# Altium schematic sheet 03_Power.SchDoc
size 297 x 209 mm; SheetNumber: 3; SheetTotal: 5; Page Create Date: March  8, 1995; Page Number: 3; Page Size: A4; Reviewer: Default; Page Count: 5; Designer: Dennis; Page Name: 03_Power; RevCode: 1.0; DsnPath: H:\PCB\2026\狼王傻波一\20260204_V0_ELRS-RX\ELRS-RX-MODULE-V11\ELRS-RX-MODULE-V11-20260127.DSN; SchematicName: SCHEMATIC1; PageName: 03_Power; PageSize: A4; TopSchematic: True
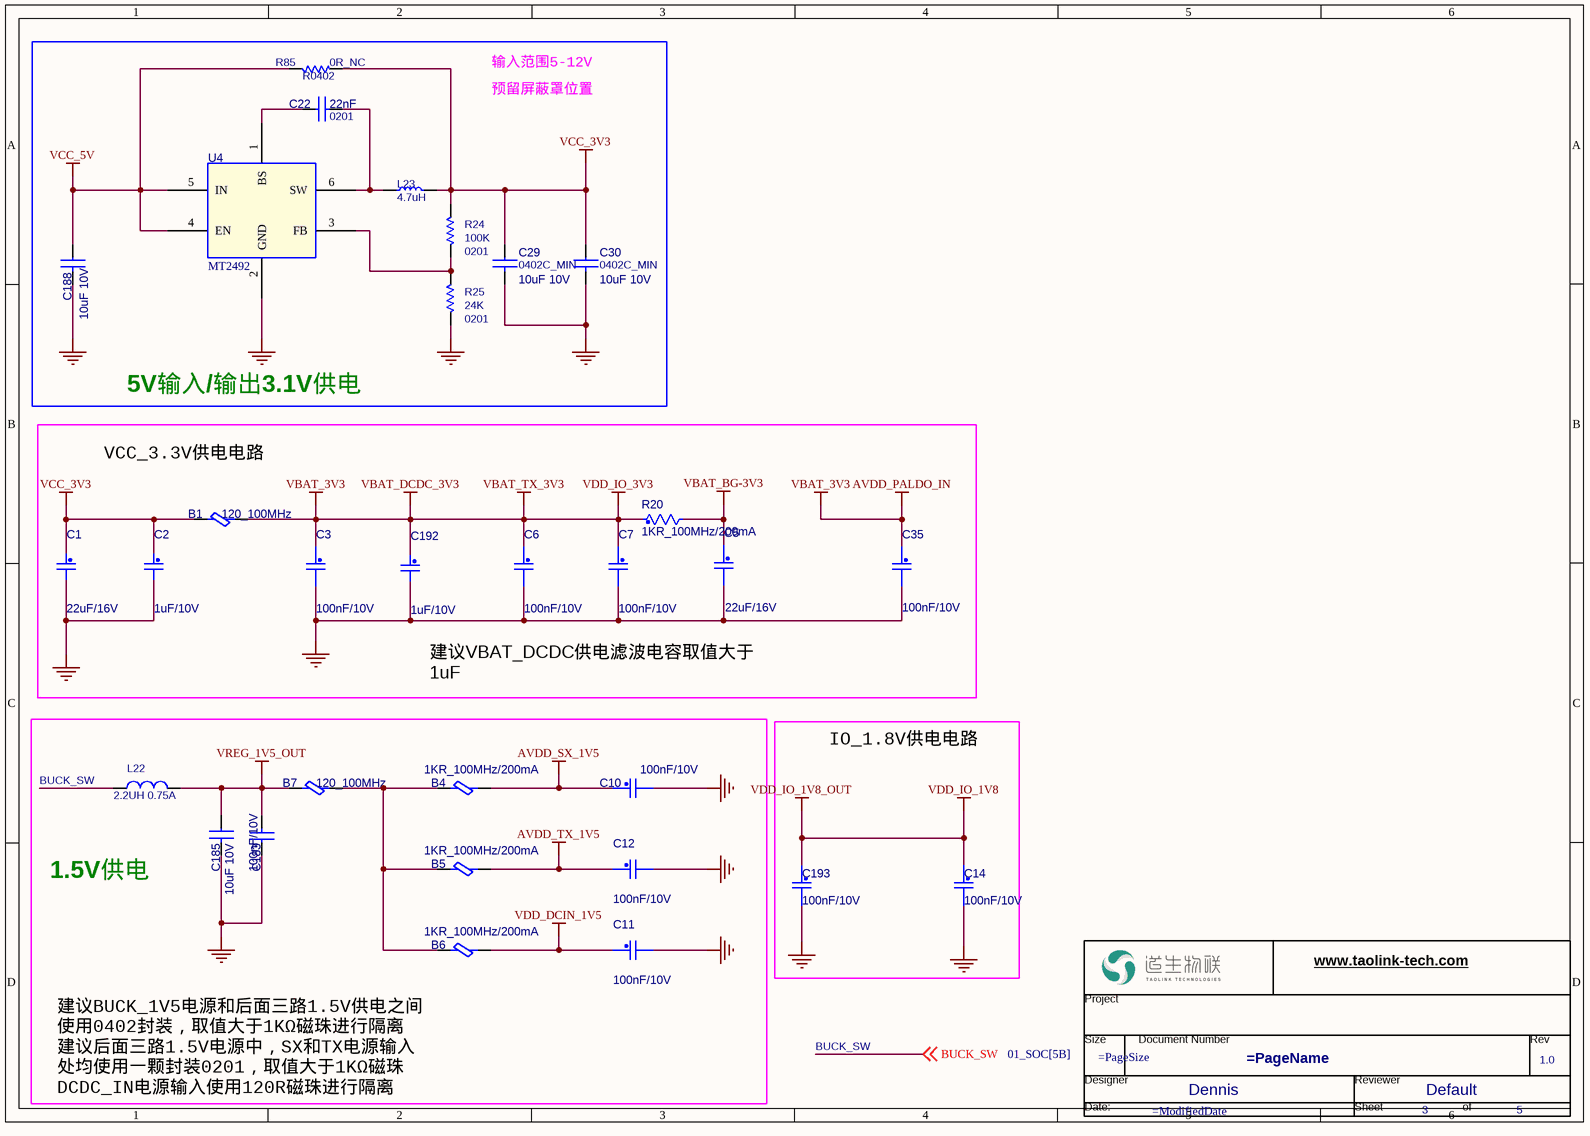
[diagram p0: 03_Power.SchDoc]

## Parts
*  RevCode: 1.0  Designer: Dennis  Reviewer: Default  Page Number: 3  Page Count: 5  (graphical)
B1  120_100MHz  [l0402]
B4  1KR_100MHz/200mA  [0201]
B5  1KR_100MHz/200mA  [0201]
B6  1KR_100MHz/200mA  [0201]
B7  120_100MHz  [l0402]
C1  22uF/16V  [C0402]
C2  1uF/10V  [0201]
C3  100nF/10V  [0201]
C5  22uF/16V  [C0402]
C6  100nF/10V  [0201]
C7  100nF/10V  [0201]
C10  100nF/10V  [0201]
C11  100nF/10V  [0201]
C12  100nF/10V  [0201]
C14  100nF/10V  [0201]
C22  22nF  [0201]
C29  10uF 10V  [0402C_MIN]
C30  10uF 10V  [0402C_MIN]
C35  100nF/10V  [0201]
C183  100nF/10V  [0201]
C185  10uF 10V  [0402C_MIN]
C188  10uF 10V  [0402C_MIN]
C192  1uF/10V  [0201]
C193  100nF/10V  [0201]
L22  2.2UH 0.75A  [C0603]
L23  4.7uH  [R0603]
R20  1KR_100MHz/200mA  [0201]
R24  100K  [0201]
R25  24K  [0201]
R85  0R_NC  [R0402]
U4  MT2492  [SOT23-6]

## Blocks framed on the sheet
5V输入/输出3.1V供电: C22 C29 C30 C188 L23 R24 R25 R85 U4
VCC_3.3V供电电路: B1 C1-C3 C5-C7 C35 C192 R20
1.5V供电: B4-B7 C10-C12 C183 C185 L22
IO_1.8V供电电路: C14 C193

## Nets
AVDD_PALDO_IN: B1.2 C3.1 C6.1 C7.1 C35.1 C192.1 R20.1  [also labelled VBAT_3V3, VBAT_DCDC_3V3, VBAT_TX_3V3, VDD_IO_3V3]
AVDD_SX_1V5: B4.2 C10.1
AVDD_TX_1V5: B5.2 C12.1
GND: C1.2 C2.2 C3.2 C5.2 C6.2 C7.2 C10.2 C11.2 C12.2 C14.2 C29.2 C30.2 C35.2 C183.1 C185.2 C188.2 C192.2 C193.2 R25.2 U4.2(GND)
VBAT_BG-3V3: C5.1 R20.2
VCC_3V3: B1.1 C1.1 C2.1 C29.1 C30.1 L23.2 R24.1 R85.2
VCC_5V: C188.1 R85.1 U4.4(EN) U4.5(IN)
VDD_DCIN_1V5: B6.2 C11.1
VDD_IO_1V8: C14.1 C193.1  [also labelled VDD_IO_1V8_OUT]
VREG_1V5_OUT: B7.1 C183.2 C185.1 L22.2
BUCK_SW: L22.1 ; off-sheet BUCK_SW
NetB4_1: B4.1 B5.1 B6.1 B7.2
NetC22_1: C22.1 U4.1(BS)
NetC22_2: C22.2 L23.1 U4.6(SW)
NetR24_2: R24.2 R25.1 U4.3(FB)

## Notes on the sheet
- 输入范围5-12V
- 预留屏蔽罩位置
- 建议VBAT_DCDC供电滤波电容取值大于1uF
  建议VBAT_BG供电滤波电容取值大于10uF
- (near B6) 建议BUCK_1V5电源和后面三路1.5V供电之间
  使用0402封装，取值大于1KΩ磁珠进行隔离
  建议后面三路1.5V电源中，SX和TX电源输入
  处均使用一颗封装0201，取值大于1KΩ磁珠
  DCDC_IN电源输入使用120R磁珠进行隔离
- (in symbol TaoLin_DesignName) www.taolink-tech.com; Project; Size; Document Number; Rev; Designer; Reviewer; Date:; Sheet; of

## Library data of the parts
* = TaoLin_DesignName: Page Create Date: March  8, 1995; Page Size: =PageSize; Page Name: =PageName; Page Modify Date: =ModifiedDate
B1 = 1212_BEAD_0: FERRITE CHIP 120 OHM 500MA 0402; Part Reference: B1; eI Part#: 04_00075_01; Vendor Part#: 490-1005-1-ND; Mfg Part#: BLM15AG121SN1D; CLASS: DISCRETE; Mfg: Murata; Vendor: DigiKey; Oper. Temp. Range: -55C to 85C; Tolerance: 25%; ProcessType: SMT; Value: 120_100MHz; PCB Footprint: l0402; RoHS: Yes; Package: L0201; Manufacture Part Number: BLM15AG121SN1D
B4 = 1212_BEAD_0: FERRITE CHIP 120 OHM 500MA 0402; Part Reference: B4; Manufacture Part Number: BLM15AG121SN1D; Vendor Part#: 490-1005-1-ND; eI Part#: 04_00075_01; CLASS: DISCRETE; ProcessType: SMT; Tolerance: 25%; Oper. Temp. Range: -55C to 85C; Vendor: DigiKey; Mfg: Murata; Value: 1KR_100MHz/200mA; PCB Footprint: 0201; Package: 0402; Mfg Part#: BLM15AG121SN1D; RoHS: Yes
B5 = 1212_BEAD_0: FERRITE CHIP 120 OHM 500MA 0402; Part Reference: B5; Manufacture Part Number: BLM15AG121SN1D; Vendor Part#: 490-1005-1-ND; eI Part#: 04_00075_01; CLASS: DISCRETE; ProcessType: SMT; Tolerance: 25%; Oper. Temp. Range: -55C to 85C; Vendor: DigiKey; Mfg: Murata; Value: 1KR_100MHz/200mA; PCB Footprint: 0201; Package: 0402; Mfg Part#: BLM15AG121SN1D; RoHS: Yes
B6 = 1212_BEAD_0: FERRITE CHIP 120 OHM 500MA 0402; Part Reference: B6; Manufacture Part Number: BLM15AG121SN1D; Vendor Part#: 490-1005-1-ND; eI Part#: 04_00075_01; CLASS: DISCRETE; ProcessType: SMT; Tolerance: 25%; Oper. Temp. Range: -55C to 85C; Vendor: DigiKey; Mfg: Murata; Value: 1KR_100MHz/200mA; PCB Footprint: 0201; Package: 0402; Mfg Part#: BLM15AG121SN1D; RoHS: Yes
B7 = 1212_BEAD_0: FERRITE CHIP 120 OHM 500MA 0402; Part Reference: B7; Manufacture Part Number: BLM15AG121SN1D; Vendor Part#: 490-1005-1-ND; eI Part#: 04_00075_01; CLASS: DISCRETE; ProcessType: SMT; Tolerance: 25%; Oper. Temp. Range: -55C to 85C; Vendor: DigiKey; Mfg: Murata; Value: 120_100MHz; PCB Footprint: l0402; Package: 0402; Mfg Part#: BLM15AG121SN1D; RoHS: Yes
C1 = Ceramic Capacitor: Ceramic Capacitor, 10uF,+/-20%,X6S,16V,SMD,0603; Part Reference: C1; Manufacturer P/N: GRM188C81C106MA73D; Manufacturer: Murata; Myir P/N: 2040100037; Value: 22uF/16V; PCB Footprint: C0402; Datasheet: Ceramic Capacitor.pdf; Reserve Value: 10uF; Part Type: Ceramic Capacitor
C2 = Ceramic Capacitor: Ceramic Capacitor,4.7uF 10V 0402,SUMSUNG; Part Reference: C2; Manufacturer P/N: CL05A475MP5NRNC; Manufacturer: Samsung; Myir P/N: 2040180055; Value: 1uF/10V; PCB Footprint: 0201; Datasheet: CL05A475MP5NRNC.pdf; Reserve Value: 4.7uF; Part Type: Ceramic Capacitor
C3 = Ceramic Capacitor_14: Ceramic Capacitor,100nF,50V,+/-10%,X7R,0402,Fenghua; Part Reference: C3; Manufacturer P/N: 0402B104K500NT; Myir P/N: 2040180111; Value: 100nF/10V; PCB Footprint: 0201; Datasheet: 附件7 风华片容全系列承认书.pdf; Reserve Value: 100nF; Manufacturer: Fenghua; Part Type: Ceramic Capacitor
C5 = Ceramic Capacitor_14: Ceramic Capacitor,100nF,50V,+/-10%,X7R,0402,Fenghua; Part Reference: C5; Manufacturer P/N: 0402B104K500NT; Myir P/N: 2040180111; Value: 22uF/16V; PCB Footprint: C0402; Part Type: Ceramic Capacitor; Manufacturer: Fenghua; Reserve Value: 100nF; Datasheet: 附件7 风华片容全系列承认书.pdf
C6 = Ceramic Capacitor_14: Ceramic Capacitor,100nF,50V,+/-10%,X7R,0402,Fenghua; Part Reference: C6; Manufacturer P/N: 0402B104K500NT; Myir P/N: 2040180111; Value: 100nF/10V; PCB Footprint: 0201; Datasheet: 附件7 风华片容全系列承认书.pdf; Reserve Value: 100nF; Manufacturer: Fenghua; Part Type: Ceramic Capacitor
C7 = Ceramic Capacitor_14: Ceramic Capacitor,100nF,50V,+/-10%,X7R,0402,Fenghua; Part Reference: C7; Manufacturer P/N: 0402B104K500NT; Myir P/N: 2040180111; Value: 100nF/10V; PCB Footprint: 0201; Datasheet: 附件7 风华片容全系列承认书.pdf; Reserve Value: 100nF; Manufacturer: Fenghua; Part Type: Ceramic Capacitor
C10 = Ceramic Capacitor_14: Ceramic Capacitor,100nF,50V,+/-10%,X7R,0402,Fenghua; Part Reference: C10; Manufacturer P/N: 0402B104K500NT; Myir P/N: 2040180111; Value: 100nF/10V; PCB Footprint: 0201; Datasheet: 附件7 风华片容全系列承认书.pdf; Reserve Value: 100nF; Manufacturer: Fenghua; Part Type: Ceramic Capacitor
C11 = Ceramic Capacitor_14: Ceramic Capacitor,100nF,50V,+/-10%,X7R,0402,Fenghua; Part Reference: C11; Manufacturer P/N: 0402B104K500NT; Myir P/N: 2040180111; Value: 100nF/10V; PCB Footprint: 0201; Datasheet: 附件7 风华片容全系列承认书.pdf; Reserve Value: 100nF; Manufacturer: Fenghua; Part Type: Ceramic Capacitor
C12 = Ceramic Capacitor_14: Ceramic Capacitor,100nF,50V,+/-10%,X7R,0402,Fenghua; Part Reference: C12; Manufacturer P/N: 0402B104K500NT; Myir P/N: 2040180111; Value: 100nF/10V; PCB Footprint: 0201; Part Type: Ceramic Capacitor; Manufacturer: Fenghua; Reserve Value: 100nF; Datasheet: 附件7 风华片容全系列承认书.pdf
C14 = Ceramic Capacitor_14: Ceramic Capacitor,100nF,50V,+/-10%,X7R,0402,Fenghua; Part Reference: C14; Manufacturer P/N: 0402B104K500NT; Myir P/N: 2040180111; Value: 100nF/10V; PCB Footprint: 0201; Part Type: Ceramic Capacitor; Manufacturer: Fenghua; Reserve Value: 100nF; Datasheet: 附件7 风华片容全系列承认书.pdf
C22 = CAPACITOR NON-POL: Part Reference: C22; Value: 22nF; PCB Footprint: 0201
C29 = CAPACITOR NON-POL: Part Reference: C29; Value: 10uF 10V; PCB Footprint: 0402C_MIN
C30 = CAPACITOR NON-POL: Part Reference: C30; Value: 10uF 10V; PCB Footprint: 0402C_MIN
C35 = Ceramic Capacitor_14: Ceramic Capacitor,100nF,50V,+/-10%,X7R,0402,Fenghua; Part Reference: C35; Manufacturer P/N: 0402B104K500NT; Myir P/N: 2040180111; Value: 100nF/10V; PCB Footprint: 0201; Part Type: Ceramic Capacitor; Manufacturer: Fenghua; Reserve Value: 100nF; Datasheet: 附件7 风华片容全系列承认书.pdf
C183 = CAP_NP: Part Reference: C183; 存货简称: TURBO; 型号: 100nF 16V; 规格: 贴片电容－0.1uF－±10%－16V－X7R－0402; 存货名称: 贴片电容; 存货编码: 040203017; FPLIST: 0402C_S,0402C,0402C_M,0402C_MIN,0402C-BGA,C0402; Value: 100nF/10V; PCB Footprint: 0201
C185 = CAP_NP: Part Reference: C185; 存货简称: TURBO; 型号: 10uF 6.3V; 规格: 贴片电容－10uF－±20%－6.3V－X5R－0402; 存货名称: 贴片电容; 存货编码: 040203157; FPLIST: 0402C_S,0402C,0402C_M,0402C_MIN,0402C-BGA,C0402; Value: 10uF 10V; PCB Footprint: 0402C_MIN
C188 = CAP_NP: Part Reference: C188; FPLIST: 0402C_S,0402C,0402C_M,0402C_MIN,0402C-BGA,C0402; 存货编码: 040203157; 存货名称: 贴片电容; 规格: 贴片电容－10uF－±20%－6.3V－X5R－0402; 型号: 10uF 6.3V; 存货简称: TURBO; Value: 10uF 10V; PCB Footprint: 0402C_MIN
C192 = Ceramic Capacitor: Ceramic Capacitor,4.7uF 10V 0402,SUMSUNG; Part Reference: C192; Manufacturer: Samsung; Manufacturer P/N: CL05A475MP5NRNC; Myir P/N: 2040180055; Value: 1uF/10V; PCB Footprint: 0201; Part Type: Ceramic Capacitor; Reserve Value: 4.7uF; Datasheet: CL05A475MP5NRNC.pdf
C193 = Ceramic Capacitor_14: Ceramic Capacitor,100nF,50V,+/-10%,X7R,0402,Fenghua; Part Reference: C193; Manufacturer P/N: 0402B104K500NT; Myir P/N: 2040180111; Value: 100nF/10V; PCB Footprint: 0201; Part Type: Ceramic Capacitor; Manufacturer: Fenghua; Reserve Value: 100nF; Datasheet: 附件7 风华片容全系列承认书.pdf
L22 = INDUCTOR_Dup2: Part Reference: L22; FPLIST: 0603L_S,0603L,0603L_M,0603L_MIN; Reviewed2: LBY; Value: 2.2UH 0.75A; PCB Footprint: C0603
L23 = INDUCTOR_Dup1: Part Reference: L23; Reviewed: LBY; Value: 4.7uH; PCB Footprint: R0603
R20 = Resister: Thick Film Resistor,0R,+/-5%,1/16W,-55°C ~ 155°C,SMD,0402,Fenghua; Part Reference: R20; Manufacturer P/N: RC-02000JT; Myir P/N: 20301.00186; Value: 1KR_100MHz/200mA; PCB Footprint: 0201; Part Type: Thick Film Resistor; Manufacturer: Fenghua; Reserve Value: 0R; Datasheet: FH规格书_2018-07-30.pdf
R24 = R: Part Reference: R24; Value: 100K; PCB Footprint: 0201
R25 = R: Part Reference: R25; Value: 24K; PCB Footprint: 0201
R85 = R: Part Reference: R85; Value: 0R_NC; PCB Footprint: R0402
U4 = MT2492: Part Reference: U4; Value: MT2492; PCB Footprint: SOT23-6